# Altium schematic sheet schema.SchDoc
size A3; SheetNumber: 1; SheetTotal: 3
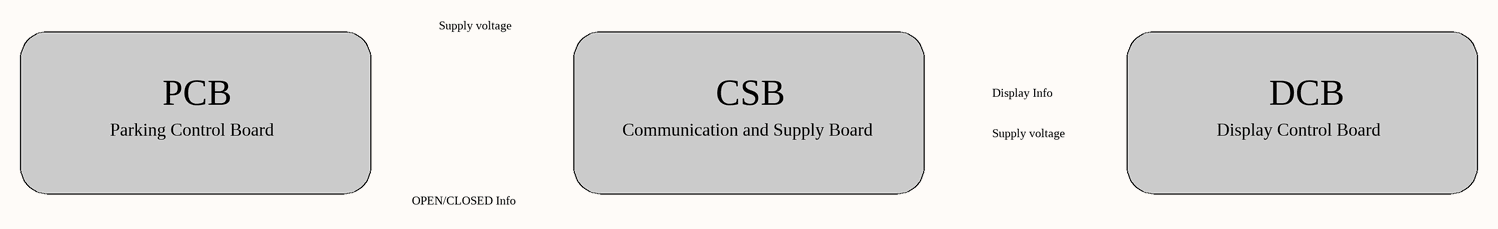
[diagram p0: schema.SchDoc]

## Notes on the sheet
- Supply voltage
- PCB
- CSB
- Display Info
- DCB
- Parking Control Board
- Communication and Supply Board
- Display Control Board
- OPEN/CLOSED Info
- Designed By:
- Electric DC engine and Battery controller
- AlvaroNJ